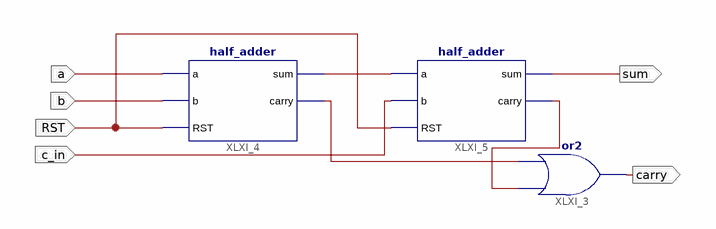
[diagram p0: schematic sheet 1]
// Xilinx ISE schematic full_adder.sch (artix7) as structural Verilog: 3 symbols, 6 ports
module full_adder (
  input  a,
  input  b,
  input  c_in,
  input  RST,
  output carry,
  output sum
);

  wire XLXN_1, XLXN_5, XLXN_6;

  or XLXI_3 (carry, XLXN_6, XLXN_5);
  half_adder XLXI_4 (.a(a), .b(b), .carry(XLXN_5), .RST(RST), .sum(XLXN_1));
  half_adder XLXI_5 (.a(XLXN_1), .b(c_in), .carry(XLXN_6), .RST(RST), .sum(sum));
endmodule
